# Altium schematic sheet EM4095_OLD.SchDoc
size A
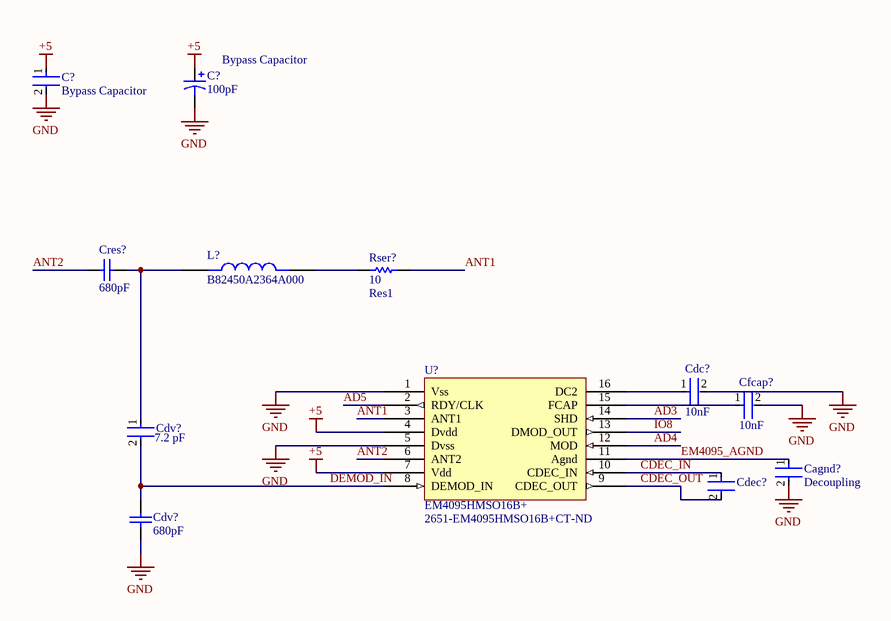
[diagram p0: EM4095_OLD.SchDoc]

## Parts
(Parts that share a designator on the sheet are numbered #1, #2 ... from top to bottom, then left to right.)
C?#1  Bypass Capacitor  [FP-CC0603-DA-MFG]
C?#2  Bypass Capacitor  value 100pF  [C1206]
Cagnd?  Decoupling  [FP-CC0603-DA-MFG]
Cdc?  10nF  [FP-C0603C-CF-MFG]
Cdec?  (no value)  [FP-CC0603-DA-MFG]
Cdv?#1  value 7.2 pF  [FP-CBR06C-MFG]  (hidden comment: CBR06C729BAGAC)
Cdv?#2  value 680pF  [C0805]
Cfcap?  10nF  [FP-C0603C-CF-MFG]
Cres?  value 680pF  [C0805]
L?  B82450A2364A000  [INDM11435X240N]
Rser?  Res1  value 10  [C1206]
U?  EM4095HMSO16B+  Supplier Part Number 1: 2651-EM4095HMSO16B+CT-ND  [SOIC16_L]

## Nets
+5: C?#1.1 C?#2.1 U?.4(Dvdd) U?.7(Vdd)
GND: C?#1.2 C?#2.2 Cagnd?.2 Cdc?.2 Cdv?#2.1 Cfcap?.2 U?.1(Vss) U?.5(Dvss)
AD3: U?.14(SHD)
AD4: U?.12(MOD)
AD5: U?.2(RDY/CLK)
ANT1: Rser?.2 U?.3(ANT1)
ANT2: Cres?.1 U?.6(ANT2)
CDEC_IN: Cdec?.1 U?.10(CDEC_IN)
CDEC_OUT: Cdec?.2 U?.9(CDEC_OUT)
DEMOD_IN: Cdv?#1.2 Cdv?#2.2 U?.8(DEMOD_IN)
EM4095_AGND: Cagnd?.1 U?.11(Agnd)
IO8: U?.13(DMOD_OUT)
NetCdc?_1: Cdc?.1 U?.16(DC2)
NetCdv?#1_1: Cdv?#1.1 Cres?.2 L?.1
NetCfcap?_1: Cfcap?.1 U?.15(FCAP)
NetL?_2: L?.2 Rser?.1

## Library data of the parts
C?#1 = CMP-03422-001228-1: CAP CER 0.1UF 10V X7R 0603; Manufacturer Part Number: CC0603KRX7R6BB104; Manufacturer: YAGEO; Material: Ceramic; Tolerance: 0.1; Capacitance: 100 nF; Temperature Coefficient: 15%; Value: 100 nF; Height: 0.9mm; RoHS: TRUE; Footprint Url: http://www.yageo.com/exep/pages/download/literatures/UPY-C_GEN_24.pdf; Octopart: https://octopart.com/cc0603krx7r6bb104-yageo-9291607; Device Class L1: Passive Components; Mouser Description: 0603 0.1 uF 10 V ±10 % Tolerance X7R SMT Multilayer Ceramic Capacitor; ComponentLink2URL: http://www.yageo.com/documents/recent/UPY-GPHC_X7R_6.3V-to-50V_18.pdf; Automotive: No; Voltage: 10 V; Device Class L3: Ceramic Capacitors; Category: Cap; Temperature: -55°C to +125°C; ComponentLink2Description: Datasheet; Voltage Rating: 10 V; Device Class L2: Capacitors; Lead Free: Yes; Temperature Range High: +125°C; Temperature Range Low: -55°C; Digikey Description: CAP CER 0.1UF 10V X7R 0603; Package: CC0603-DA; Temperature Characteristic: X7R
C?#2 = Cap Pol1: Tantalum Capacitor, Polarized, Tantalum (dry/solid), 16V, 10% +Tol, 10% -Tol, 10uF, Surface Mount, 1206; Manufacturer: Kyocera AVX; Manufacturer Part Number: TAJA106K016SNJ; ESR (Equivalent Series Resistance): 3R; Leakage Current: 1.6uA; Tan Delta: 0.08; Reference Standard: CECC30801-005; Supplier 1: Digikey; Supplier Part Number 1: 478-8875-1-ND; RoHS: Yes; Category: Tantalum Capacitors; Stock 1: 30440; Pricing 1: 1=0.36, 10=0.214, 50=0.157, 100=0.1397, 500=0.11036, 1000=0.10132, 2500=0.09178 (USD); Mounting Technology: Surface Mount; Pins: 2; Dielectric Material: Tantalum; Package Shape: Rectangular; Case/Package: 1206; Terminal Finish: Nickel; Min Operating Temperature: -55°C; Max Operating Temperature: 125°C; JESD-609 Code: e3; Polarity: Polarized; Capacitor Type: Tantalum; Tolerance  (fill in as +-): 10%; Package Style: SMTMeter; Packaging: Tape and Reel; Tolerance (fill in as +-): 10%; Rated DC Voltage (URdc): 16V; Termination: J BEND; Length: 3.2mm; Width: 1.6mm; Height: 1.6mm; Reach SVHC Compliant: Yes; RoHS Compliant: Yes; ComponentLink1URL: https://datasheet.ciiva.com:443/pdfs/VipMasterIC/IC/AVXC/AVXC-S-A0008794508/AVXC-S-A0008794508-1.pdf?src-supplier=IHS+Markit; ComponentLink1Description: https://datasheet.ciiva.com:443/pdfs/VipMasterIC/IC/AVXC/AVXC-S-A0008794508/AVXC-S-A0008794508-1.pdf?src-supplier=IHS+Markit; ComponentLink2URL: https://datasheet.ciiva.com/29500/taj-29500092.pdf?src-supplier=Digikey; ComponentLink2Description: https://datasheet.ciiva.com/29500/taj-29500092.pdf?src-supplier=Digikey; ComponentLink3URL: https://datasheet.ciiva.com/29500/taj-29500093.pdf?src-supplier=Digikey; ComponentLink3Description: https://datasheet.ciiva.com/29500/taj-29500093.pdf?src-supplier=Digikey; ComponentLink4URL: https://datasheet.ciiva.com/29500/taj-29500094.pdf?src-supplier=Digikey; ComponentLink4Description: https://datasheet.ciiva.com/29500/taj-29500094.pdf?src-supplier=Digikey; ComponentLink5URL: https://datasheet.ciiva.com/12907/taj-27497-12907453.pdf?src-supplier=Mouser; ComponentLink5Description: https://datasheet.ciiva.com/12907/taj-27497-12907453.pdf?src-supplier=Mouser
Cagnd? Cdec? = CMP-03422-001228-1: CAP CER 0.1UF 10V X7R 0603; Manufacturer Part Number: CC0603KRX7R6BB104; Manufacturer: YAGEO; Tolerance: 0.1; Capacitance: 100 nF; Temperature Coefficient: 15%; Value: 100 nF; Height: 0.9mm; Material: Ceramic; RoHS: TRUE; Footprint Url: http://www.yageo.com/exep/pages/download/literatures/UPY-C_GEN_24.pdf; Octopart: https://octopart.com/cc0603krx7r6bb104-yageo-9291607; Device Class L1: Passive Components; Mouser Description: 0603 0.1 uF 10 V ±10 % Tolerance X7R SMT Multilayer Ceramic Capacitor; ComponentLink2URL: http://www.yageo.com/documents/recent/UPY-GPHC_X7R_6.3V-to-50V_18.pdf; Automotive: No; Voltage: 10 V; Device Class L3: Ceramic Capacitors; Category: Cap; Temperature: -55°C to +125°C; ComponentLink2Description: Datasheet; Voltage Rating: 10 V; Device Class L2: Capacitors; Lead Free: Yes; Temperature Range High: +125°C; Temperature Range Low: -55°C; Digikey Description: CAP CER 0.1UF 10V X7R 0603; Package: CC0603-DA; Temperature Characteristic: X7R
Cdc? Cfcap? = CMP-2006-03048-2: CAP CER 10000PF 10V X7R 0603; Manufacturer: KEMET; Manufacturer Part Number: C0603C103K8RACTU; Automotive Grade: Grade 1; Value: 10,000 pF; Tolerance: 0.1; Temperature Coefficient: 30ppm/°C; ComponentLink2Description: Datasheet; Automotive: Yes; Mouser Description: Multilayer Ceramic Capacitors MLCC - SMD/SMT 10volts 10000pF X7R 10%; Device Class L3: Ceramic Capacitors; Octopart: https://octopart.com/c0603c103k8ractu-kemet-8375724; Material: Ceramic; Digikey Description: CAP CER 10000PF 10V X7R 0603; Temperature: -55°C to +125°C; Temperature Characteristic: X7R; Device Class L1: Passive Components; Capacitance: 10,000 pF; Lead Free: Yes; Voltage Rating: 10 V; Category: Cap; Height: 0.87mm; Package: C0603C-CF; RoHS: TRUE; Temperature Range High: +125°C; Device Class L2: Capacitors; ComponentLink2URL: https://api.kemet.com/component-edge/download/datasheet/C0603C100J5GACAUTO.pdf; Temperature Range Low: -55°C
Cdv?#1 = CMP-03020-004850-1: CBR0603 7.2 pF C0G 30ppm/°C 0.1 pF 250 V; Manufacturer: KEMET; Tolerance: 0.1 pF; Voltage Rating: 250 V; Dielectric Material: Ceramic; Multilayer: Yes; Tolerance  (fill in as +-): 1.3889%; Rated DC Voltage (URdc): 250V; Lead Free: Yes; Category: Cap; Device Class L3: Ceramic Capacitors; Manufacturer Part Number: CBR06C729BAGAC; ComponentLink2URL: https://content.kemet.com/datasheets/KEM_C1030_CBR_SMD.pdf; Temperature Coefficient: 30ppm/°C; Temperature Characteristic: C0G; Ipc Land Pattern Name: CAPC16080X80; Package: CBR06C; Temperature Range Low: -55°C; Temperature Range High: +125°C; Material: Ceramic; Temperature: -55°C to +125°C; Automotive: No; Device Class L1: Passive Components; Capacitance: 7.2 pF; ComponentLink2Description: Datasheet; Height: 0.87mm; Octopart: https://octopart.com/cbr06c729bagac-kemet-84758813; RoHS: TRUE; Device Class L2: Capacitors; Supplier 1: Digikey; Supplier Part Number 1: 399-16240-1-ND; Stock 1: 3890; Pricing 1: 1=0.8, 10=0.501, 100=0.3498, 1000=0.27097 (USD); Pins: 2; Case/Package: 0603; Terminal Finish: Tin; Min Operating Temperature: -55°C; Max Operating Temperature: 125°C; JESD-609 Code: e3; Capacitor Type: Ceramic; Package Style: SMTMeter; Packaging: Tape and Reel; Tolerance (fill in as +-): 1.3889%; Temperature Characteristics Code: C0G; Length: 1.6mm; Width: 0.8mm; Reach SVHC Compliant: Yes; RoHS Compliant: Yes; ComponentLink1URL: https://datasheet.ciiva.com:443/pdfs/VipMasterIC/IC/KEME/KEME-S-A0008534334/KEME-S-A0008534334-1.pdf?src-supplier=IHS+Markit; ComponentLink1Description: https://datasheet.ciiva.com:443/pdfs/VipMasterIC/IC/KEME/KEME-S-A0008534334/KEME-S-A0008534334-1.pdf?src-supplier=IHS+Markit; ComponentLink3URL: https://datasheet.octopart.com/CBR06C729BAGAC-KEMET-datasheet-86449590.pdf?src-supplier=Element14; ComponentLink3Description: https://datasheet.octopart.com/CBR06C729BAGAC-KEMET-datasheet-86449590.pdf?src-supplier=Element14
Cdv?#2 Cres? = Cap: Surface Mount Ceramic Multilayer Capacitor 680pF 10% X7R 500V 0805 Paper T/R; Manufacturer: Yageo; Manufacturer Part Number: CC0805KRX7RBBB681; Supplier 1: Digikey; Supplier Part Number 1: 13-CC0805KRX7RBBB681CT-ND; RoHS: No; Category: Ceramic Capacitors; Stock 1: 6677; Pricing 1: 1=0.12, 10=0.068, 100=0.0409, 1000=0.0271 (USD)
Rser? = Res1: Fixed Resistor, Thin Film, 1W, 10ohm, 200V, 0.5% +/-Tol, 50ppm/Cel, Surface Mount, 1206; Manufacturer: Susumu; Manufacturer Part Number: HRG3216Q-10R0-D-T1; Additional Feature: ANTI-SULFUR; Rated Temperature: 70°C; Temperature Coefficient (ppm/Cel): 50; Package Height: 0.4mm; Package Length: 3.2mm; Package Width: 1.6mm; Reference Standard: AEC-Q200; Supplier 1: Digikey; Supplier Part Number 1: 408-1869-1-ND; RoHS: Yes; Category: Chip SMD Resistors; Stock 1: 208868; Pricing 1: 1=0.64, 10=0.531, 50=0.465, 100=0.44, 500=0.36166 (USD); Mounting Technology: Surface Mount; Pins: 2; Case/Package: 1206; Min Operating Temperature: -55°C; Max Operating Temperature: 155°C; Tolerance: 0.5%; Resistor Type: FIXED RESISTOR; Construction: Rectangular; Packaging: Tape and Reel; Power: 1W; Technology: THIN FILM; Termination: Wraparound; Working Voltage: 200V; Reach SVHC Compliant: Yes; RoHS Compliant: Yes; ComponentLink1URL: https://datasheet.ciiva.com:443/pdfs/VipMasterIC/IC/SUSU/SUSU-S-A0004582570/SUSU-S-A0004582570-1.pdf?src-supplier=IHS+Markit; ComponentLink1Description: https://datasheet.ciiva.com:443/pdfs/VipMasterIC/IC/SUSU/SUSU-S-A0004582570/SUSU-S-A0004582570-1.pdf?src-supplier=IHS+Markit; ComponentLink2URL: http://www.farnell.com/datasheets/2643250.pdf?src-supplier=Farnell; ComponentLink2Description: http://www.farnell.com/datasheets/2643250.pdf?src-supplier=Farnell; ComponentLink3URL: http://www.susumu.co.jp/common/pdf/n_catalog_partition24_en.pdf?src-supplier=Digikey; ComponentLink3Description: http://www.susumu.co.jp/common/pdf/n_catalog_partition24_en.pdf?src-supplier=Digikey; ComponentLink4URL: http://www.farnell.com/datasheets/2643250.pdf?src-supplier=Newark; ComponentLink4Description: http://www.farnell.com/datasheets/2643250.pdf?src-supplier=Newark; ComponentLink5URL: https://datasheet.octopart.com/HRG3216Q-10R0-D-T1-Susumu-datasheet-117013349.pdf?src-supplier=Future+Electronics; ComponentLink5Description: https://datasheet.octopart.com/HRG3216Q-10R0-D-T1-Susumu-datasheet-117013349.pdf?src-supplier=Future+Electronics
U? = EM4095HMSO16B+: Analog Circuit, 1 Func, CMOS, PDSO16; Manufacturer: EM Microelectronic; Supplier 1: Digikey; Manufacturer Part Number: EM4095HMSO16B+; RoHS: Yes; Category: LDO; Stock 1: 52534; Pricing 1: 1=4.25, 10=3.676, 25=3.476, 100=3.2005, 250=3.03532, 500=2.9187, 1000=2.80881 (USD); RoHS Compliant: Yes; ComponentLink1URL: https://datasheet.octopart.com/EM4095HMSO16B%2B-EM-Microelectronic-Marin-datasheet-112341807.pdf?src-supplier=TME; ComponentLink1Description: https://datasheet.octopart.com/EM4095HMSO16B%2B-EM-Microelectronic-Marin-datasheet-112341807.pdf?src-supplier=TME
L? = B82450A2364A000: Price: None; MP: B82450A2364A000; Availability: Unavailable; Value: *; Package: None